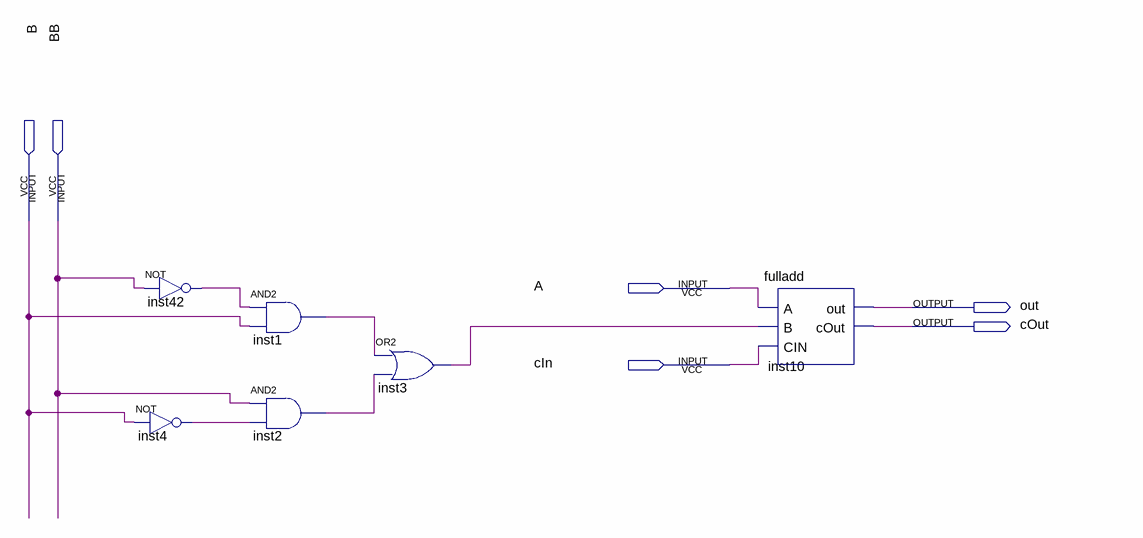
[diagram p0: schematic sheet]
// Quartus schematic sub.bdf as structural Verilog: 6 symbols, 6 pins
module sub (
  input  B,
  input  BB,
  input  A,
  input  cIn,
  output out,
  output cOut
);

  wire inst1_out, inst2_out, inst3_out, inst4_out, inst42_out;

  not inst42 (inst42_out, BB);
  not inst4 (inst4_out, B);
  and inst1 (inst1_out, inst42_out, B);
  and inst2 (inst2_out, BB, inst4_out);
  or inst3 (inst3_out, inst1_out, inst2_out);
  fulladd inst10 (.A(A), .B(inst3_out), .CIN(cIn), .out(out), .cOut(cOut));
endmodule
